# EAGLE schematic coqui-dip (EAGLE 7.1.0)
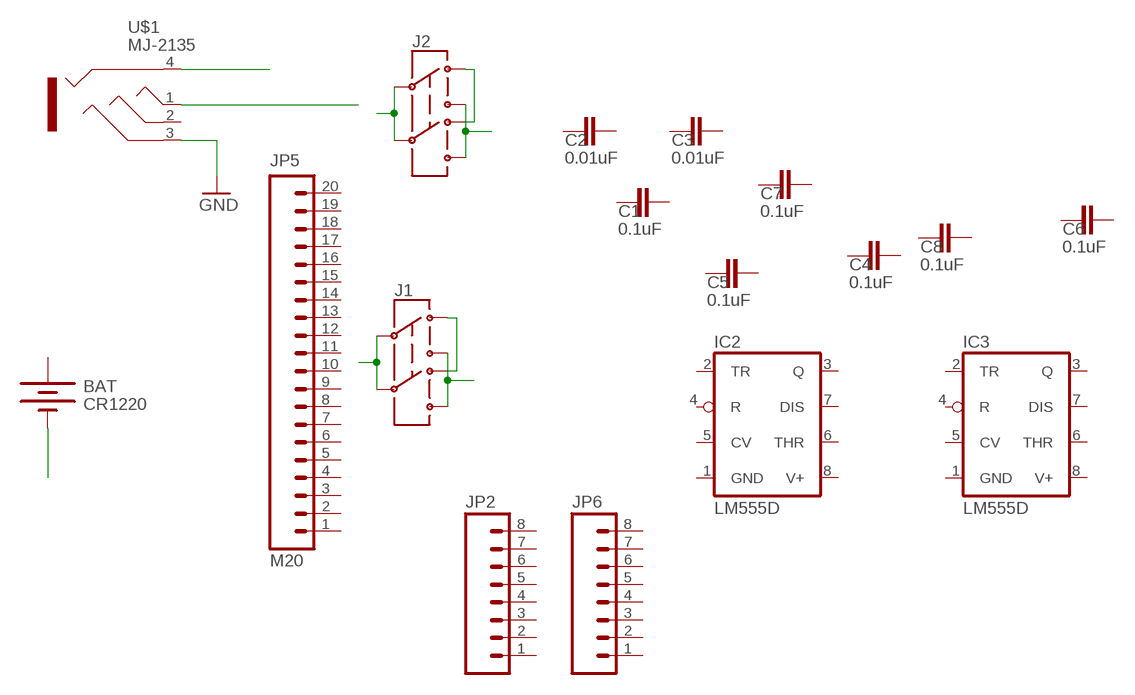
[diagram p0: schematic, sheet 1]

## Parts
BAT  CR1220  BATTERYBATTERY_12MM_SMT  [BATTCON_12MM_SMT]
C1  0.1uF  C-EUC0805  [C0805@1]
C2  0.01uF  C-EUC0805  [C0805@1]
C3  0.01uF  C-EUC0805  [C0805@1]
C4  0.1uF  C-EUC0805  [C0805@1]
C5  0.1uF  C-EUC0805  [C0805@1]
C6  0.1uF  C-EUC0805  [C0805@1]
C7  0.1uF  C-EUC0805  [C0805@1]
C8  0.1uF  C-EUC0805  [C0805@1]
IC2  LM555D  [SO08]
IC3  LM555D  [SO08]
J1  AYZ0202  [AYZ0202]
J2  AYZ0202  [AYZ0202]
JP2  M081X08  [1X08]
JP5  M20  [1X20]
JP6  M081X08  [1X08]
U$1  MJ-2135  [MJ-2135]

## Nets
GND: U$1.3
GND1: BAT.P$1(-)
N$1: U$1.4
N$2: J1.3 J1.6
N$3: J2.3 J2.6
N$6: U$1.1
VBAT: J1.2 J1.5
VBAT1: J2.2 J2.5
VDD: J1.1 J1.4
VDD1: J2.1 J2.4
Unconnected: C1.1 C1.2 C2.1 C2.2 C3.1 C3.2 C4.1 C4.2 C5.1 C5.2 C6.1 C6.2 C7.1 C7.2 C8.1 C8.2 IC2.2(TR) IC2.3(Q) IC2.4(R) IC2.5(CV) IC2.6(THR) IC2.7(DIS) IC3.2(TR) IC3.3(Q) IC3.4(R) IC3.5(CV) IC3.6(THR) IC3.7(DIS) JP2.1 JP2.2 JP2.3 JP2.4 JP2.5 JP2.6 JP2.7 JP2.8 JP5.1 JP5.2 JP5.3 JP5.4 JP5.5 JP5.6 JP5.7 JP5.8 JP5.9 JP5.10 JP5.11 JP5.12 JP5.13 JP5.14 JP5.15 JP5.16 JP5.17 JP5.18 JP5.19 JP5.20 JP6.1 JP6.2 JP6.3 JP6.4 JP6.5 JP6.6 JP6.7 JP6.8 U$1.2

## Power pins joined to a net without a drawn wire
+: BAT.P$2(+)
GND: IC2.1(GND) IC3.1(GND)
V+: IC2.8(V+) IC3.8(V+)

## Library data of the parts
BAT = SparkFunNew:BATTERY: Battery Holders Various common sizes : AA, AAA, 20mm coin cell and 12mm coin cell.
C1-C8 = rcl:C-EU: CAPACITOR, European symbol
IC2 IC3 = adafruit:*555: TIMER Changed DIP package to have round (not oval) pin pads http://www.ladyada.net/library/pcb/eaglelibrary.html
J1 J2 = SparkFunNew:AYZ0202: SPDT Slide Switch Simple SMD single-pull double-throw slide switch. Good for less than 350mA power switch, switching UARTs between devices, etc. Spark Fun Electronics SKU : COM-00597
JP2 JP6 = SparkFun-Connectors:M08: Header 8 Standard 8-pin 0.1" header. Use with straight break away headers (SKU : PRT-00116), right angle break away headers (PRT-00553), swiss pins (PRT-00743), machine pins (PRT-00117), and female headers (PRT-00115).
JP5 = SparkFun-Connectors:M20: 1x20 .1" header This is just like the LOCK variant in that the holes are staggared by 5 mil, but except for the last two holes. They are not altered from the "standard" footprint layout. This is used for a special purpose on the layout of our Graphic LCD Backpack. Make sure you want to use this device before selecting it for you project!
U$1 = iPhoneSoftModem:MJ-2135

## Net classes
0 default: width 0.203 mm, drill 0.33 mm, clearance 0.203 mm